# EAGLE design ICSP_Inline_Pogo (EAGLE 6.5.0)
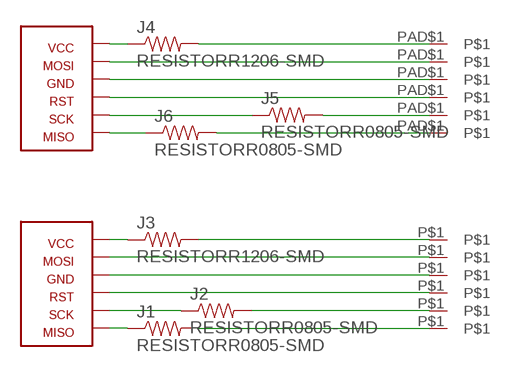
[diagram p0: schematic, sheet 1]

## Parts
GND  POGO_PADR50  [P50_POGO_PIN]
GND1  POGO_PADR75  [P75_POGO_PIN]
J1  RESISTORR0805-SMD  [R0805]
J2  RESISTORR0805-SMD  [R0805]
J3  RESISTORR1206-SMD  [R1206]
J4  RESISTORR1206-SMD  [R1206]
J5  RESISTORR0805-SMD  [R0805]
J6  RESISTORR0805-SMD  [R0805]
MISO  POGO_PADR50  [P50_POGO_PIN]
MISO1  POGO_PADR75  [P75_POGO_PIN]
MOSI  POGO_PADR50  [P50_POGO_PIN]
MOSI1  POGO_PADR75  [P75_POGO_PIN]
RST  POGO_PADR50  [P50_POGO_PIN]
RST1  POGO_PADR75  [P75_POGO_PIN]
SCK  POGO_PADR50  [P50_POGO_PIN]
SCK1  POGO_PADR75  [P75_POGO_PIN]
U$1  AVR_ICSP_6P2X3_THP  [AVR_ICSP_2X3_THP]
U$3  AVR_ICSP_6P2X3_THP  [AVR_ICSP_2X3_THP]
VCC  POGO_PADR50  [P50_POGO_PIN]
VCC1  POGO_PADR75  [P75_POGO_PIN]

## Nets
GND: GND.P$1 U$3.GND
GND1: GND1.PAD$1 U$1.GND
MISO: J1.1 U$3.MISO
MISO1: J6.2 MISO1.PAD$1
MOSI: MOSI.P$1 U$3.MOSI
MOSI1: MOSI1.PAD$1 U$1.MOSI
N$1: J1.2 MISO.P$1
N$2: J3.1 U$3.VCC
N$3: J2.1 U$3.SCK
N$6: J6.1 U$1.MISO
N$7: J5.2 SCK1.PAD$1
N$8: J4.1 U$1.VCC
RST: RST.P$1 U$3.RST
RST1: RST1.PAD$1 U$1.RST
SCK: J2.2 SCK.P$1
SCK1: J5.1 U$1.SCK
VCC: J3.2 VCC.P$1
VCC1: J4.2 VCC1.PAD$1

## Library data of the parts
GND GND1 MISO MISO1 MOSI MOSI1 RST RST1 SCK SCK1 VCC VCC1 = AVR_ICSP_Footprints:POGO_PAD
J1-J6 = My Custom Parts:RESISTOR: SMD chip resistors
U$1 U$3 = AVR_ICSP_Footprints:AVR_ICSP_6P

## Board
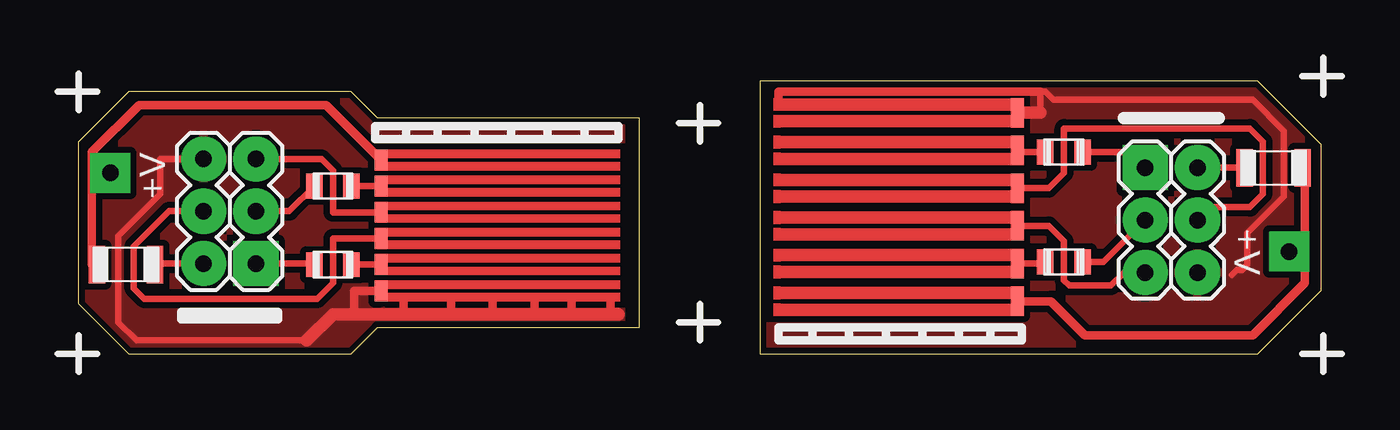
[diagram p1: board, top side]
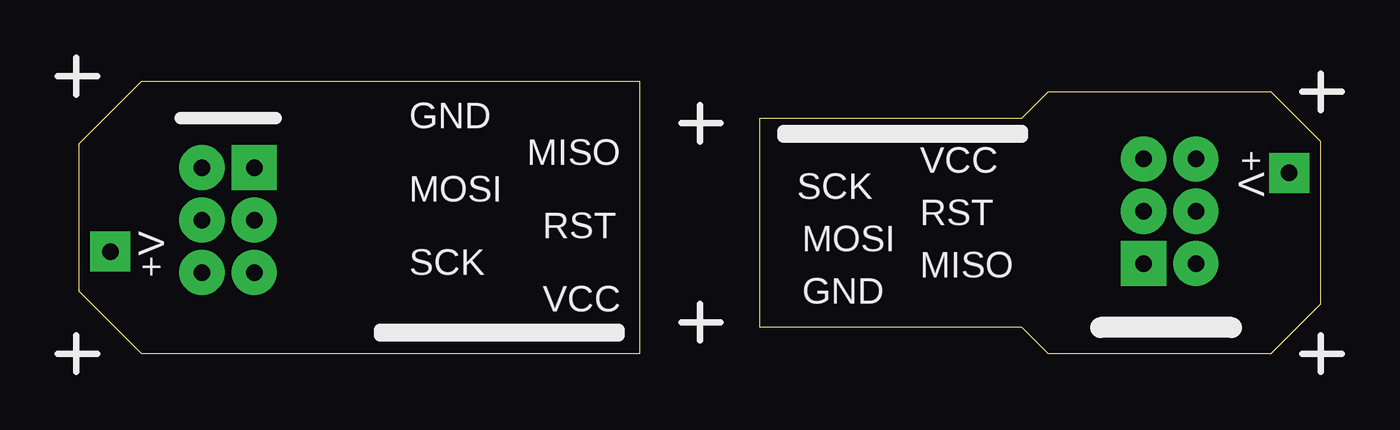
[diagram p2: board, bottom side, seen from below]

Size 60.2 x 13.21 mm. Coordinates in mm from the lower left corner, seen from the top.
Outline: 27.18,1.27 27.18,11.43 14.48,11.43 13.21,12.7 2.41,12.7 0,10.29 0,2.41 2.41,0 13.21,0 14.48,1.27 27.18,1.27
Outline: 33.02,13.21 33.02,0 57.15,0 60.2,3.05 60.2,10.16 57.15,13.21 33.02,13.21
Copper layers (1*16): Top 0.035mm / dielectric 1.5mm / Bottom 0.035mm
Design rules "default *": minimum track width 10mil, minimum drill 24mil, track to track 12mil, track to pad 12mil, pad to pad 12mil, via to via 12mil, smd to smd 12mil, copper to edge 12mil, drill to drill 12mil, minimum pad ring 2mil, minimum via ring 2mil, stop-mask expansion 2mil, vias tented up to drill 0mil, thermal gap 12mil

### Footprints (pad centres in the part's own frame; a part is rotated, then mirrored left to right if it is on the bottom)
P50_POGO_PIN = smd 1.016 x 0.635: P$1 0,0.025
P75_POGO_PIN = smd 1.422 x 0.635: PAD$1 0,0.025
R0805 = smd 0.8 x 1.2: 1 -0.9,0; 2 0.9,0
R1206 = smd 0.8 x 1.8: 1 -1.4,0; 2 1.4,0
AVR_ICSP_2X3_THP = drill 0.8 pad 2.184: GND 5.08,2.54; MOSI 2.54,2.54; RST 5.08,0; SCK 2.54,0; VCC 0,2.54 | drill 0.8 pad 2.184 square: MISO 0,0

### Placement (x,y rotation side)
GND  14.68,3.05 90 top
GND1  45.47,11.68 270 top
J1  12.32,4.32 0 top
J2  12.32,8.13 0 top
J3  2.29,4.32 180 top
J4  57.91,9.02 0 top
J5  47.75,4.45 180 top
J6  47.75,9.78 180 top
MISO  14.68,4.32 90 top
MISO1  45.47,9.86 270 top
MOSI  14.68,5.59 90 top
MOSI1  45.47,8.03 270 top
RST  14.68,6.86 90 top
RST1  45.47,6.2 270 top
SCK  14.68,8.13 90 top
SCK1  45.47,4.37 270 top
U$1  51.69,9.02 270 top
U$3  8.59,4.37 90 top
VCC  14.68,9.4 90 top
VCC1  45.47,2.54 270 top

### Tracks (layer width: path | path; a pad name or v marks a point on that pad's centre or on a via)
GND
  Top 0.305: 11.05,0.64 2.79,0.64 1.9,1.52 1.9,5.71 3.94,7.75 3.94,9.45 U$3.GND
  Top 0.406: GND.P$1 13.34,3.05 13.34,1.9 | 15.75,1.9 15.75,2.67 | 18.03,2.03 18.03,2.67 | 20.07,2.03 20.07,2.67 | 22.1,2.03 22.1,2.67 | 23.88,2.03 23.88,2.67 | 25.78,2.54 25.78,2.03 26.16,2.03 26.16,1.9
  Top 0.61: 11.05,0.64 12.32,1.9 13.34,1.9 15.75,1.9 26.16,1.9
  pour Top: -0.13,1.9 2.41,0 13.21,0 14.48,1.27 26.29,1.27 26.29,11.43 14.48,11.43 13.21,12.7 2.41,12.7 -0.13,10.8
GND1
  Top 0.305: 33.91,12.07 36.07,12.07 36.2,12.19 40.39,12.19 | 42.8,12.19 45.09,12.19 45.09,12.09 GND1.PAD$1 | 46.61,11.68 46.61,12.7 46.86,12.7 47.24,12.32 56.9,12.32 58.42,10.8 58.42,7.62 56.64,5.84 56.64,4.32 56.39,4.06 56.13,4.06 55.88,3.81
  Top 0.406: 33.91,12.07 33.91,12.7 46.61,12.7
  Top 0.61: 46.61,11.68 GND1.PAD$1
  pour Top: 32.89,13.21 57.78,13.21 60.58,10.41 60.07,2.79 57.53,0.25 32.89,-0.25
MISO
  Top 0.305: J1.1 11.37,4.37 U$3.MISO
MISO1
  Top 0.305: J6.2 45.57,9.78
  Top 0.406: 45.57,9.78 MISO1.PAD$1
MOSI
  Top 0.305: MOSI.P$1 12.32,5.59 12.32,3.43 11.56,2.67 3.17,2.67 2.67,3.17 2.67,5.21 4.37,6.91 U$3.MOSI
MOSI1
  Top 0.305: MOSI1.PAD$1 47.02,8.03 47.75,8.76 47.75,10.92 56.77,10.92 57.4,10.29 57.4,7.75 56.77,7.11 54.23,7.11 U$1.MOSI
N$1
  Top 0.305: J1.2 MISO.P$1
N$2
  Top 0.305: J3.1 3.69,4.37 U$3.VCC
N$3
  Top 0.305: J2.1 10.2,6.91 U$3.SCK
N$4  (via drill 0.8 pad 1.93)
  other vias: 58.67,4.95
N$5  (via drill 0.8 pad 1.93)
  other vias: 1.52,8.76
N$6
  Top 0.305: J6.1 50.93,9.78 U$1.MISO
N$7
  Top 0.305: SCK1.PAD$1 46.78,4.37
  Top 0.406: 46.78,4.37 J5.2
N$8
  Top 0.305: J4.1 U$1.VCC
N$9
  Top 0.305: 0,13.59 0,11.81
N$10
  Top 0.305: 0.89,12.7 -1.02,12.7
N$11
  Top 0.305: 0,0.89 0,-0.89
N$12
  Top 0.305: 0.89,0 -1.02,0
N$13
  Top 0.305: 30.1,12.07 30.1,10.29
N$14
  Top 0.305: 30.99,11.18 29.08,11.18
N$15
  Top 0.305: 30.1,2.41 30.1,0.64
N$16
  Top 0.305: 30.99,1.52 29.08,1.52
N$17
  Top 0.305: 60.32,14.35 60.32,12.57
N$18
  Top 0.305: 61.21,13.46 59.31,13.46
N$19
  Top 0.305: 60.32,0.89 60.32,-0.89
N$20
  Top 0.305: 61.21,0 59.31,0
N$21
  Bottom 0.305: 0,13.59 0,11.81
N$22
  Bottom 0.305: -1.02,12.7 0.89,12.7
N$23
  Bottom 0.305: 0,0.89 0,-0.89
N$24
  Bottom 0.305: -1.02,0 0.89,0
N$25
  Bottom 0.305: 29.08,1.52 30.99,1.52
N$26
  Bottom 0.305: 30.1,2.41 30.1,0.64
N$27
  Bottom 0.305: 60.32,0.89 60.32,-0.89
N$28
  Bottom 0.305: 61.21,0 59.31,0
N$29
  Bottom 0.305: 60.32,14.35 60.32,12.57
N$30
  Bottom 0.305: 61.21,13.46 59.31,13.46
N$31
  Bottom 0.305: 30.1,12.07 30.1,10.29
N$32
  Bottom 0.305: 30.99,11.18 29.08,11.18
RST
  Top 0.305: RST.P$1 12.32,6.86 12.32,8.89 11.76,9.45 U$3.RST
RST1
  Top 0.305: RST1.PAD$1 47.02,6.2 47.75,5.46 47.75,3.56 48.01,3.3 50.04,3.3 50.67,3.94 U$1.RST
SCK
  Top 0.305: J2.2 SCK.P$1
SCK1
  Top 0.305: J5.1 49.66,4.45 U$1.SCK
VCC
  Top 0.406: VCC.P$1 11.99,12.07 2.92,12.07 0.64,9.78 0.64,8.89 | 0.64,8.89 0.64,4.32 J3.2 | 1.52,8.89 0.64,8.89
VCC1
  Top 0.406: VCC1.PAD$1 47.12,2.54 48.77,0.89 56.9,0.89 59.44,3.43 59.44,8.89 J4.2

### Text on the board
tNames: The 6-Pin header is mounted / to the COMPONENT side! | 1.27mm | 1.83mm | +V | +V
bNames: GND | +V | MISO | VCC | SCK | MOSI | RST | RST | +V | MOSI | MISO | SCK | GND | VCC